# EasyEDA Pro project MCP41010_移相器.eprj

# Schematic Schematic1
Board Name: Board1; Create Date: 2025-01-24; Page Name: P1; Project Name: 移相器; Schematic Name: Schematic1; Update Date: 2025-01-27; Company: 嘉立创EDA; Page Size: A4; Version: V1.0
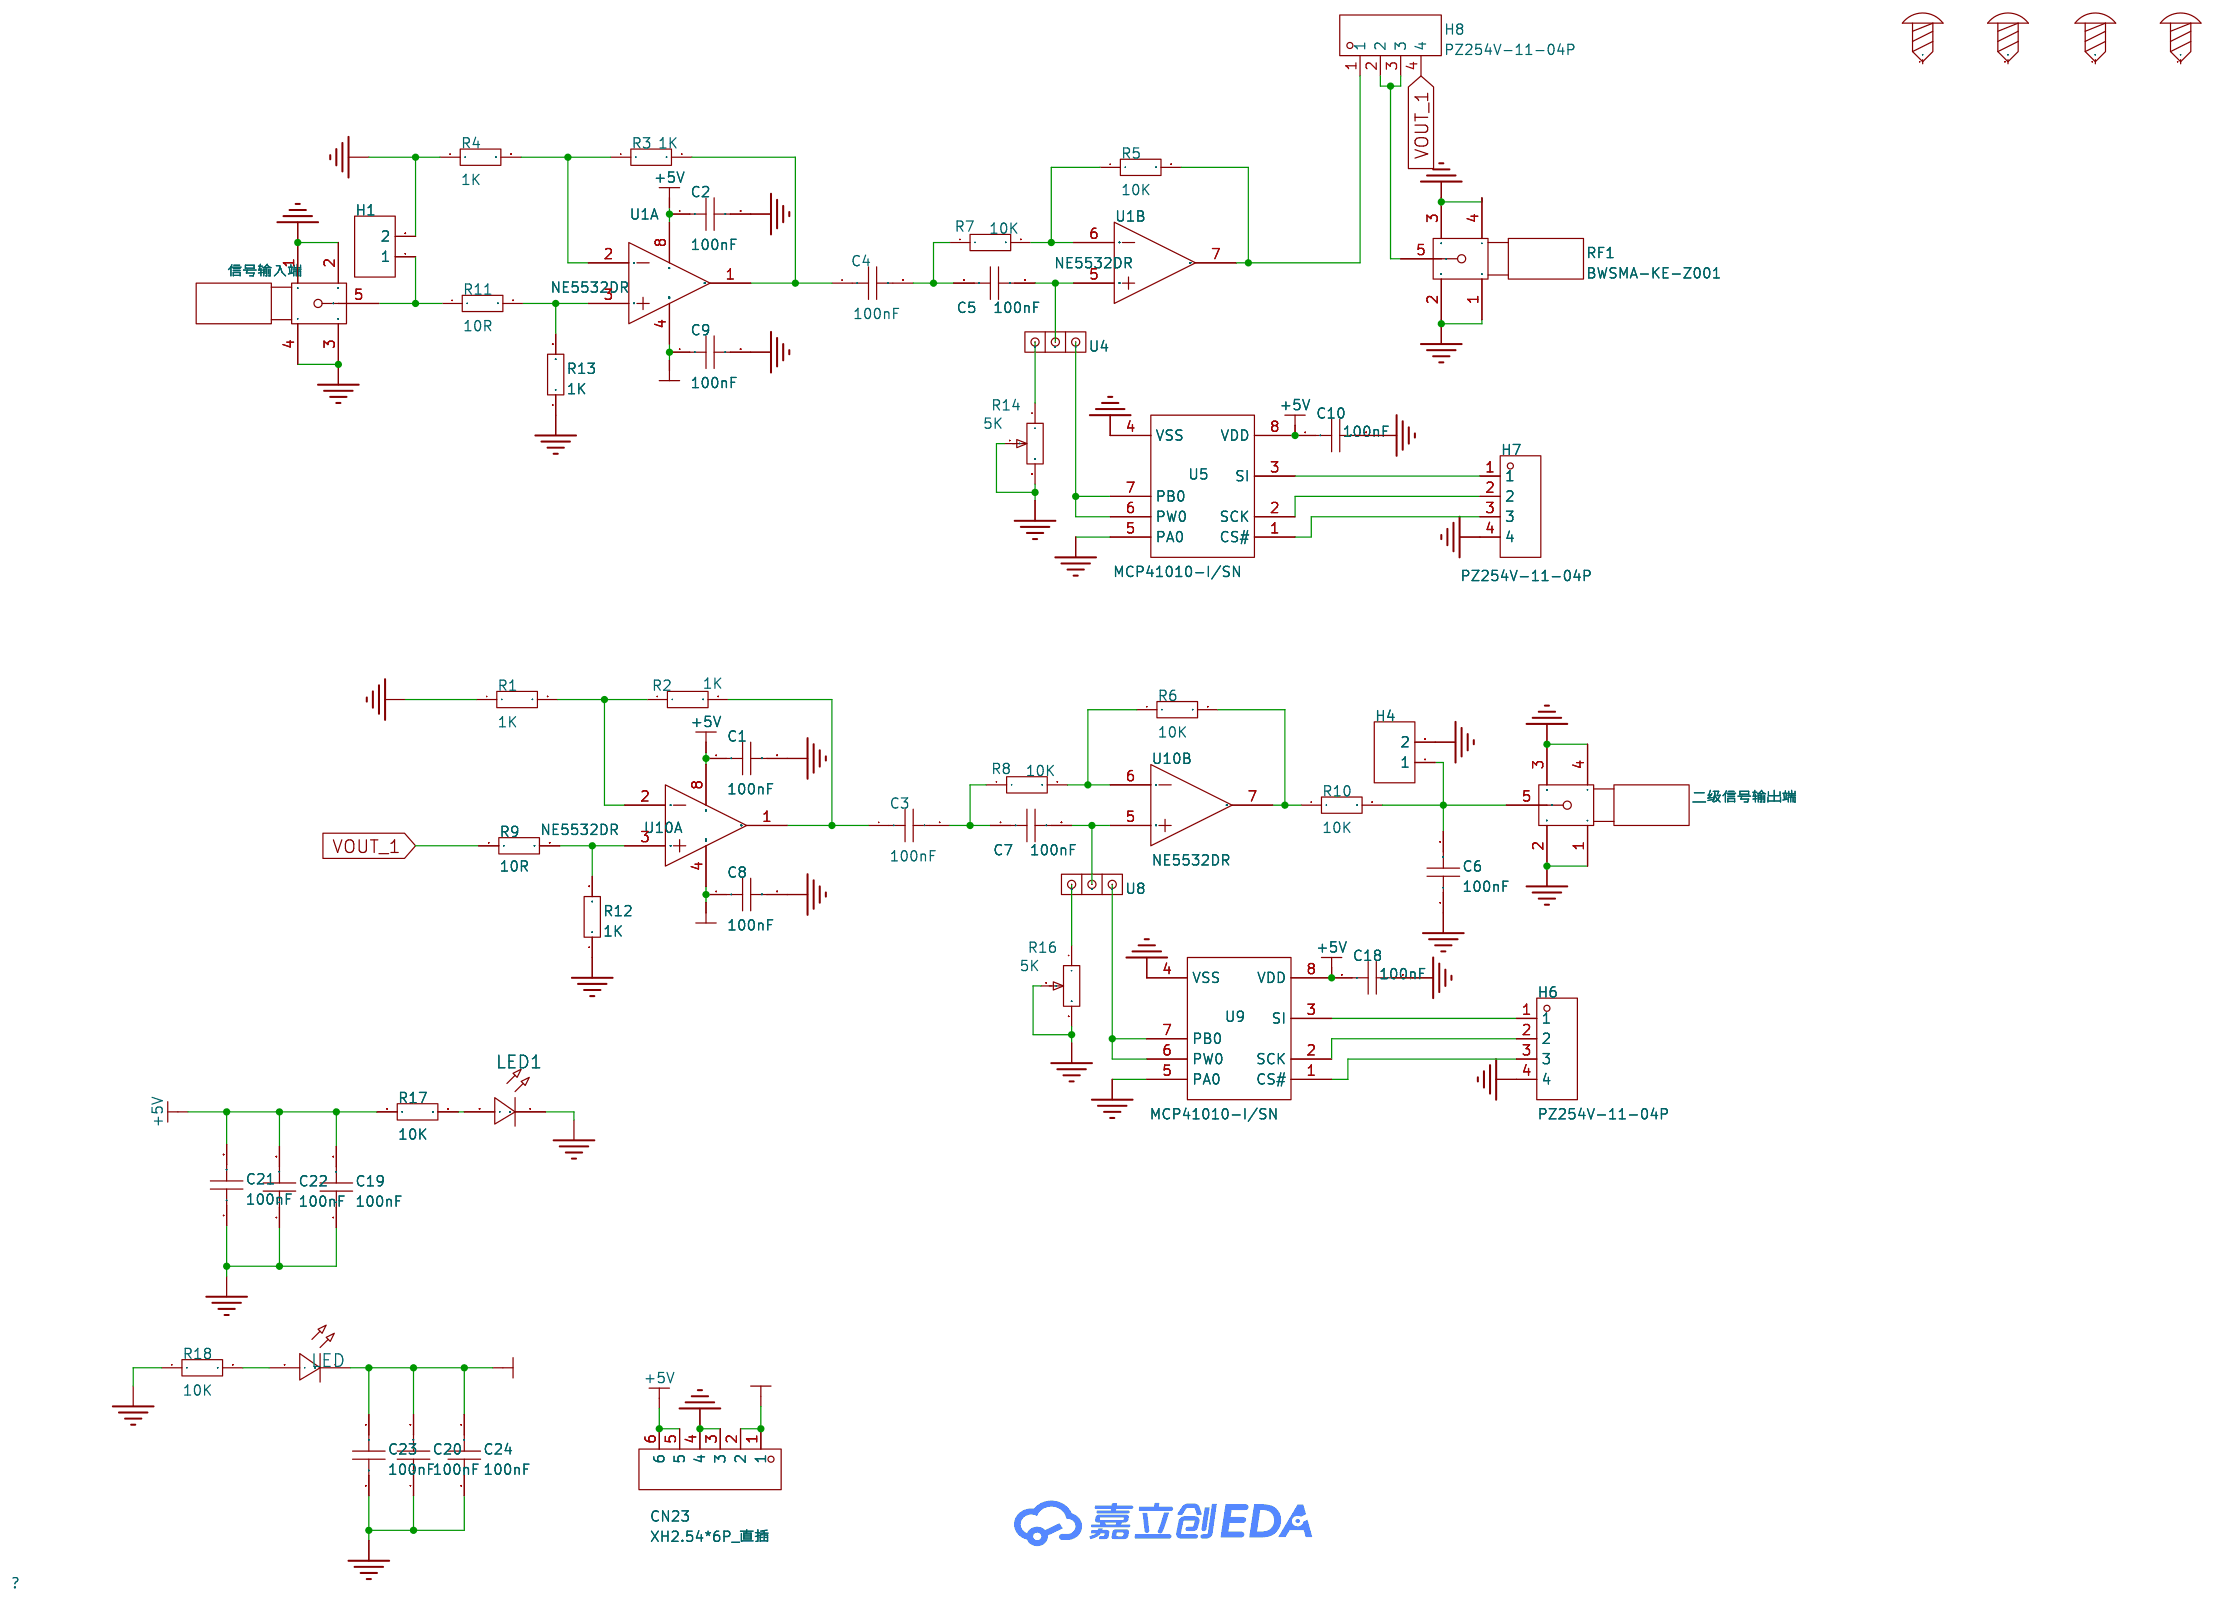
[diagram p0: schematic sheet]

## Parts
C1  100nF  [C0805]
C2  100nF  [C0805]
C3  100nF  [C0805]
C4  100nF  [C0805]
C5  100nF  [C0805]
C6  100nF  [C0805]
C7  100nF  [C0805]
C8  100nF  [C0805]
C9  100nF  [C0805]
C10  100nF  [C0805]
C18  100nF  [C0805]
C19  100nF  [C1206]
C20  100nF  [C1206]
C21  100nF  [C0805]
C22  100nF  [C0805]
C23  100nF  [C0805]
C24  100nF  [C0805]
CN23  XH2.54*6P_直插  [CONN-TH_XH2.54-6P]
H1  -  [HDR-TH_2P-P2.54-V-F]
H4  -  [HDR-TH_2P-P2.54-V-F]
H6  PZ254V-11-04P  [HDR-TH_4P-P2.54-V-M]
H7  PZ254V-11-04P  [HDR-TH_4P-P2.54-V-M]
H8  PZ254V-11-04P  [HDR-TH_4P-P2.54-V-M]
LED  -  [LED_0805]
LED1  -  [LED_0805]
R1  1K  [R0805]
R2  1K  [R0805]
R3  1K  [R0805]
R4  1K  [R0805]
R5  10K  [R0805]
R6  10K  [R0805]
R7  10K  [R0805]
R8  10K  [R0805]
R9  10R  [R0805]
R10  10K  [R0805]
R11  10R  [R0805]
R12  1K  [R0805]
R13  1K  [R0805]
R14  5K  [R_3296]
R16  5K  [R_3296]
R17  10K  [R0805]
R18  10K  [R0805]
RF1  BWSMA-KE-Z001  [SMA-TH_BWSMA-KE-Z001]
SCREW1  -  [M3螺丝]
SCREW2  -  [M3螺丝]
SCREW3  -  [M3螺丝]
SCREW4  -  [M3螺丝]
U1  NE5532DR  [SOIC-8_L4.9-W3.9-P1.27-LS6.0-BL]  (sections 1,2)
U4  -  [1*3跳线]
U5  MCP41010-I/SN  [SOIC-8_L4.9-W3.9-P1.27-LS6.0-BL]
U8  -  [1*3跳线]
U9  MCP41010-I/SN  [SOIC-8_L4.9-W3.9-P1.27-LS6.0-BL]
U10  NE5532DR  [SOIC-8_L4.9-W3.9-P1.27-LS6.0-BL]  (sections 1,2)
二级信号输出端  -  [SMA]
信号输入端  -  [SMA]

## Library data of the parts
C1-C10 C18 C21-C24 = CAP_0805: Supplier Footprint: 0805
C19 C20 = CAP_1206: Supplier Footprint: 1206
CN23 = XH2.54*6P_直插: Supplier Part: C9900008614; Supplier Footprint: XH2.54_6P; JLCPCB Part Class: 扩展库; Supplier: LCSC
H1 H4 = HDR-F_2.54_1x2P: Supplier Part: C49661; Supplier Footprint: 插件
H6-H8 = PZ254V-11-04P: LCSC Part Name: 间距:2.54mm 1x4P 直插 方针; Supplier Part: C2691448; Manufacturer: XFCN(兴飞); Supplier Footprint: 插件,P=2.54mm; JLCPCB Part Class: 扩展库; Datasheet: https://atta.szlcsc.com/upload/public/pdf/source/20200309/C492403_F9F19131791D08044AD4F84F8E751A34.pdf; Supplier: LCSC; Pin Structure: 1x4P; Pitch: 2.54mm; Circluar Pins/Square Pins: 方针; Mounting Type: 直插; Number of Rows: 单排; Number of Pins: 4P; Current Rating (Max): 3A; Voltage Rating (Max): 250V; Length of Mating Pin: 6mm; Insulation Height: 2.5mm; Length of End Connection Pin: 3mm; Operating Temperature Range: -40℃~+105℃; Color: 黑色
LED LED1 = LED_0805-R: Supplier Footprint: 0805
R1-R13 R17 R18 = Res_0805: Supplier Footprint: 0805
R14 R16 = R_3296: Supplier Footprint: 直插
RF1 = BWSMA-KE-Z001_C496549: LCSC Part Name: 内孔 SMA 正脚; Supplier Part: C496549; Manufacturer: BAT WIRELESS(蝙蝠无线); Supplier Footprint: 插件; JLCPCB Part Class: Extended Part; Datasheet: https://atta.szlcsc.com/upload/public/pdf/source/20221228/40BF41E56A06003A0210E1785CA66EA6.pdf; Supplier: LCSC; Connector Type: 板端; Interface Type: 内孔; Number of Ports: 1; RF Series: SMA; Impedance: 50Ω; Style: 正脚; Operating Temperature Range: -65℃~+165℃
SCREW1-SCREW4 = M3螺丝: Supplier Footprint: 插件
U1 U10 = NE5532DR: Supplier Part: C7426; Manufacturer: TI(德州仪器); Supplier Footprint: SOIC-8; JLCPCB Part Class: 基础库; Datasheet: http://www.ti.com/cn/lit/gpn/ne5532; Supplier: LCSC; Number of Circuits: 双路; Gain Bandwidth Product(GBP): 10MHz; Current - Input Bias(Ib): 200nA; Slew Rate(SR): 9V/us; Output Current: 38mA; Supply Current: 8mA; Operating Temperature: 0℃~+70℃
U4 U8 = 1*3跳线
U5 U9 = MCP41010-I/SN: 电阻值(欧姆):10kΩ;精度:±20%;供电电压:2.7V~5.5V;接口类型:SPI;; Supplier Part: C17064; Manufacturer: MICROCHIP(美国微芯); Supplier Footprint: SOIC-8; JLCPCB Part Class: 扩展库; Datasheet: https://atta.szlcsc.com/upload/public/pdf/source/20220205/C2666606_C5E8E7A5F3891B321C1555D845654E7B.pdf; Supplier: LCSC; Resistance Value (Ohms): 10kΩ; Number of Taps: 256; Number of Channels: 1; Precision: ±20%; Supply Voltage: 2.7V~5.5V; Interface Type: SPI; Temperature Coefficient (Typ): 800ppm/℃; Operating Temperature: -40℃~+85℃
二级信号输出端 信号输入端 = SMA

## Nets
+5V: C1.1 C2.1 C10.1 C18.1 C19.2 C21.2 C22.2 CN23.5 CN23.6 R17.1 U1.8(VCC+) U5.8(VDD) U9.8(VDD) U10.8(VCC+)
-5V: C8.1 C9.1 C20.2 C23.1 C24.1 CN23.1 CN23.2 LED.1(C) U1.4(VCC-/GND) U10.4(VCC-/GND)
GND: C1.2 C2.2 C6.1 C8.2 C9.2 C10.2 C18.2 C19.1 C20.1 C21.1 C22.1 C23.2 C24.2 CN23.3 CN23.4 H1.2 H4.2 H6.4 H7.4 LED1.1(C) R1.1 R4.1 R12.1 R13.1 R14.2 R14.3 R16.2 R16.3 R18.1 RF1.1 RF1.2 RF1.3 RF1.4 U5.4(VSS) U5.5(PA0) U9.4(VSS) U9.5(PA0) 二级信号输出端.1 二级信号输出端.2 二级信号输出端.3 二级信号输出端.4 信号输入端.1 信号输入端.2 信号输入端.3 信号输入端.4
VOUT_1: H8.4 R9.1
$1N2754: LED.2(A) R18.2
$1N2755: LED1.2(A) R17.2
$1N4308: R11.2 R13.2 U1.3(IN1+)
$1N4321: R3.1 R4.2 U1.2(IN1-)
$1N4339: C4.1 R3.2 U1.1(OUT1)
$1N4471: H1.1 R11.1 信号输入端.5
$1N4505: C5.2 U1.5(IN2+) U4.2
$1N4512: C4.2 C5.1 R7.1
$1N4538: R5.1 R7.2 U1.6(IN2-)
$1N4574: H8.1 R5.2 U1.7(OUT2)
$1N5056: U4.1 U5.6(PW0) U5.7(PB0)
$1N6369: U8.1 U9.6(PW0) U9.7(PB0)
$1N6371: C3.2 C7.1 R8.1
$1N6373: C3.1 R2.2 U10.1(OUT1)
$1N6375: C6.2 H4.1 R10.2 二级信号输出端.5
$1N6376: R6.2 R10.1 U10.7(OUT2)
$1N6377: C7.2 U8.2 U10.5(IN2+)
$1N6378: R6.1 R8.2 U10.6(IN2-)
$1N6380: R1.2 R2.1 U10.2(IN1-)
$1N6381: R9.2 R12.2 U10.3(IN1+)
$1N6959: H6.1 U9.3(SI)
$1N6964: H6.2 U9.2(SCK)
$1N6973: H6.3 U9.1(CS#)
$1N7566: H7.3 U5.1(CS#)
$1N7569: H7.1 U5.3(SI)
$1N7571: H7.2 U5.2(SCK)
$1N7588: R14.1 U4.3
$1N7623: R16.1 U8.3
$1N11064: H8.2 H8.3 RF1.5

Not connected (* = marked no-connect by the designer): SCREW1 1; SCREW2 1; SCREW3 1; SCREW4 1

# Board PCB1
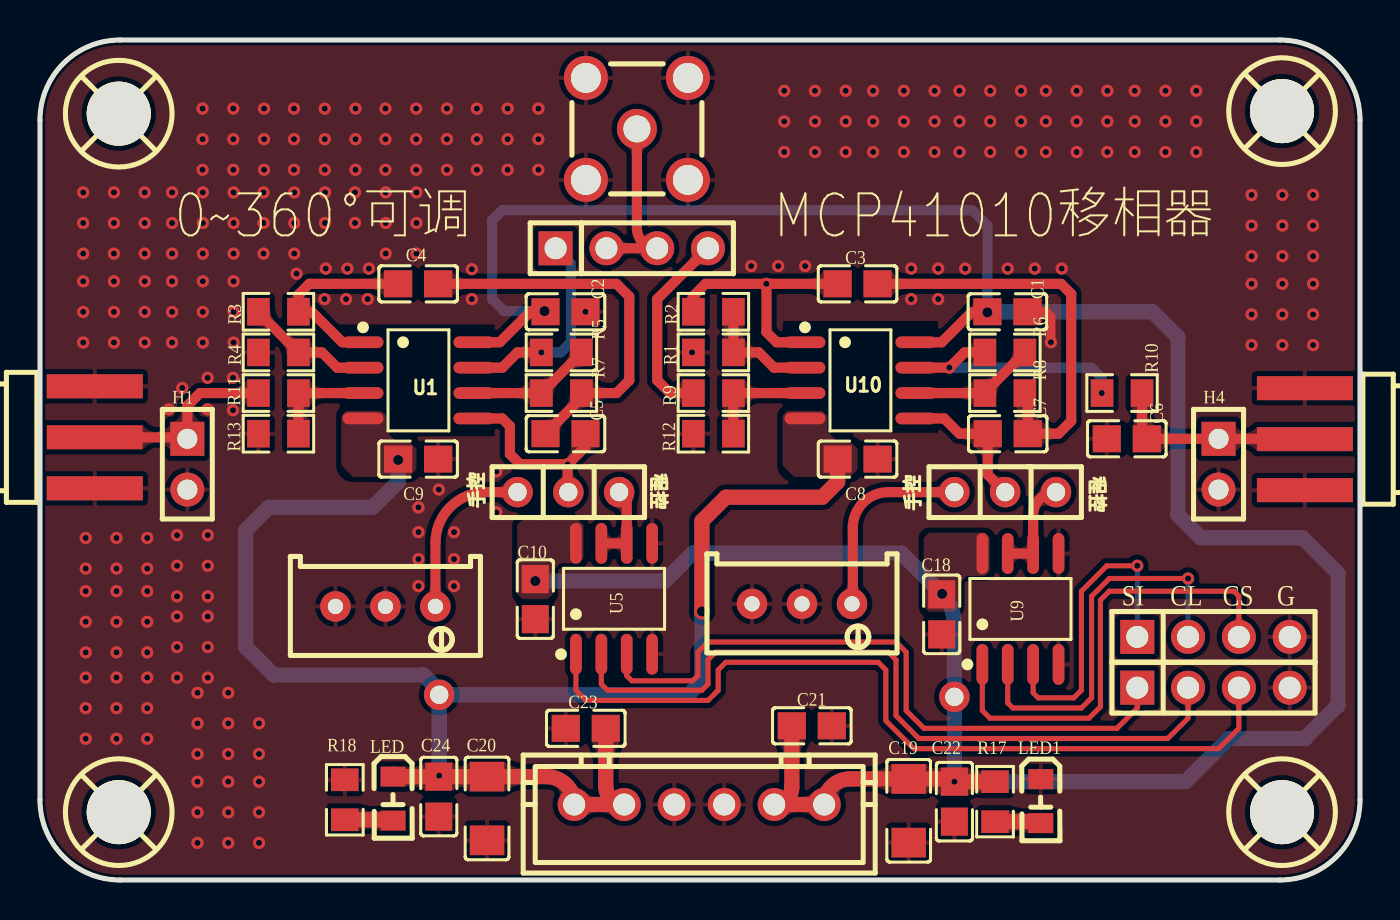
[diagram p1: board, top side]
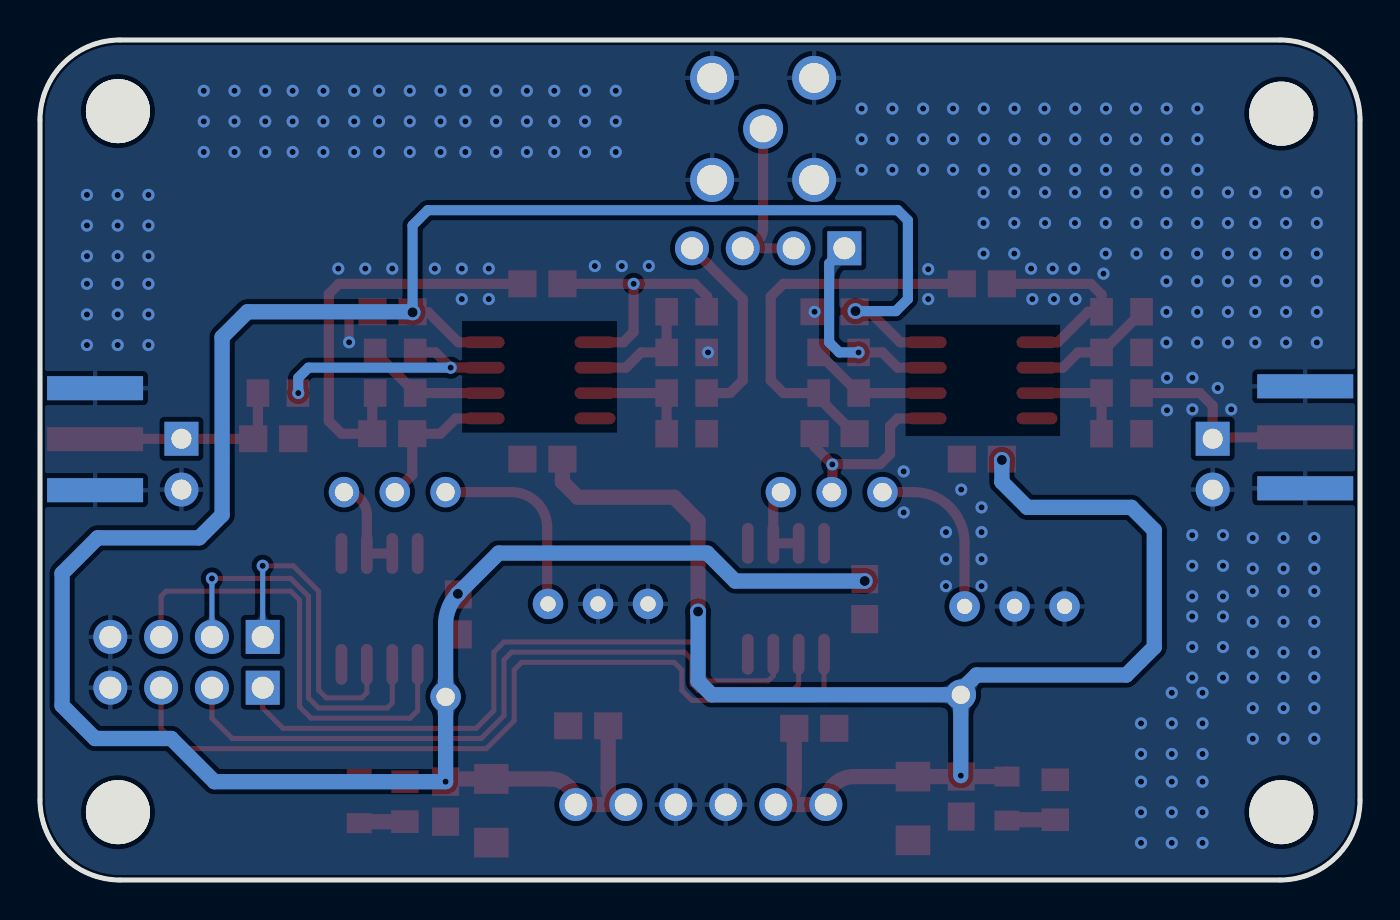
[diagram p2: board, bottom side, seen from below]

Outline 66 x 42 mm; copper layers: Top Layer, Bottom Layer. Coordinates in mm from the lower left corner of the outline.
Outline path: 0,38 0,4 arc(1.17,1.17) 4,0 62,0 arc(64.83,1.17) 66,4 66,38 arc(64.83,40.83) 62,42 4,42 arc(1.17,40.83) 0,38
Stack: Top Layer 0.035mm / Dielectric1 1.51mm FR4 er 4.5 / Bottom Layer 0.035mm

## Design rules (mm)
template: JLCPCB Capability(Two Layers Board)
spacing copperThickness1oz (default): track to track 0.102, other pairs 0.152 to 0.3
spacing copperThickness2oz: track to track 0.203, other pairs 0.152 to 0.3
track width copperThickness1oz (default): min 0.127, default 0.254, max 2.54
track width copperThickness2oz: min 0.203, default 0.254, max 2.54
differential pair differentialPair (default): width min 0.127, default 0.254, max 2.54; gap min 0.152, default 0.152
via viaSize (default): diameter min 0.5, default 0.61, max 10; hole min 0.3, default 0.305, max 6.3

## Placement (name value [footprint] x y rotation side)
C1  100nF  [C0805]  48.37 28.41 0 top
C2  100nF  [C0805]  26.27 28.41 0 top
C3  100nF  [C0805]  40.88 29.81 0 top
C4  100nF  [C0805]  18.91 29.81 0 top
C5  100nF  [C0805]  26.27 22.32 0 top
C6  100nF  [C0805]  54.34 22.06 0 top
C7  100nF  [C0805]  48.39 22.32 180 top
C8  100nF  [C0805]  40.88 21.05 0 top
C9  100nF  [C0805]  18.91 21.05 0 top
C10  100nF  [C0805]  24.76 14.04 270 top
C18  100nF  [C0805]  45.09 13.28 270 top
C19  100nF  [C1206]  43.43 3.46 90 top
C20  100nF  [C1206]  22.35 3.58 90 top
C21  100nF  [C0805]  38.59 7.71 180 top
C22  100nF  [C0805]  45.72 3.92 90 top
C23  100nF  [C0805]  27.29 7.58 180 top
C24  100nF  [C0805]  19.94 4.17 270 top
CN23  XH2.54*6P_直插  [CONN-TH_XH2.54-6P]  32.96 3.77 0 top
H1  -  [HDR-TH_2P-P2.54-V-F]  7.37 20.79 270 top
H4  -  [HDR-TH_2P-P2.54-V-F]  58.93 20.79 270 top
H6  PZ254V-11-04P  [HDR-TH_4P-P2.54-V-M]  58.67 12.16 0 top
H7  PZ254V-11-04P  [HDR-TH_4P-P2.54-V-M]  58.67 9.62 0 top
H8  PZ254V-11-04P  [HDR-TH_4P-P2.54-V-M]  29.59 31.59 0 top
LED  -  [LED_0805]  17.65 4.02 270 top
LED1  -  [LED_0805]  50.03 3.89 270 top
NOREF  -  [Pad_e531]  19.96 9.26 0 top
NOREF#2  -  [Pad_e533]  45.72 9.16 0 top
R1  1K  [R0805]  33.67 26.38 0 top
R2  1K  [R0805]  33.67 28.41 180 top
R3  1K  [R0805]  11.92 28.41 0 top
R4  1K  [R0805]  11.92 26.38 0 top
R5  10K  [R0805]  26.07 26.38 180 top
R6  10K  [R0805]  48.24 26.38 180 top
R7  10K  [R0805]  26.07 24.35 180 top
R8  10K  [R0805]  48.24 24.35 180 top
R9  10R  [R0805]  33.67 24.35 0 top
R10  10K  [R0805]  54.1 24.35 0 top
R11  10R  [R0805]  11.92 24.35 0 top
R12  1K  [R0805]  33.67 22.32 0 top
R13  1K  [R0805]  11.92 22.32 0 top
R14  5K  [R_3296]  17.27 13.55 180 top
R16  5K  [R_3296]  38.1 13.68 180 top
R17  10K  [R0805]  47.75 3.92 270 top
R18  10K  [R0805]  15.24 4.01 270 top
RF1  BWSMA-KE-Z001  [SMA-TH_BWSMA-KE-Z001]  29.84 37.56 0 top
SCREW1  -  [M3螺丝]  3.94 3.39 0 top
SCREW2  -  [M3螺丝]  62.1 38.44 0 top
SCREW3  -  [M3螺丝]  62.1 3.39 0 top
SCREW4  -  [M3螺丝]  3.94 38.32 0 top
U1  NE5532DR  [SOIC-8_L4.9-W3.9-P1.27-LS6.0-BL]  18.92 24.98 270 top
U4  -  [1*3跳线]  23.88 19.39 270 top
U5  MCP41010-I/SN  [SOIC-8_L4.9-W3.9-P1.27-LS6.0-BL]  28.7 14.06 0 top
U8  -  [1*3跳线]  45.72 19.39 270 top
U9  MCP41010-I/SN  [SOIC-8_L4.9-W3.9-P1.27-LS6.0-BL]  49.02 13.55 0 top
U10  NE5532DR  [SOIC-8_L4.9-W3.9-P1.27-LS6.0-BL]  41.02 24.98 270 top
二级信号输出端  -  [SMA]  67.06 27.9 180 top
信号输入端  -  [SMA]  -1.07 16.27 0 top

## Footprints (pads in the part's own frame, mm; a bottom-side part is the same pattern mirrored in y, then rotated)
1*3跳线
  round 1.524 hole 0.914: 1(0,5.08) 2(0,2.54) 3(0,0)
C0805
  rect 1.41x1.35 smd: 1(-1,0) 2(1,0)
C1206
  rect 1.485x1.728 smd: 1(-1.593,0) 2(1.593,0)
CONN-TH_XH2.54-6P
  round 1.65 hole 1.1: 1(-6.25,0) 2(-3.75,0) 3(-1.25,0) 4(1.25,0) 5(3.75,0) 6(6.25,0)
HDR-TH_2P-P2.54-V-F
  rect 1.7x1.7 hole 1: 1(-1.27,0)
  round 1.7 hole 1: 2(1.27,0)
HDR-TH_4P-P2.54-V-M
  rect 1.7x1.7 hole 1.1: 1(-3.81,0)
  round 1.7 hole 1.1: 2(-1.27,0) 3(1.27,0) 4(3.81,0)
LED_0805
  rect 1x1.25 smd: 1(-1.15,0.005) 2(1.05,0.005)
M3螺丝
  round 3.2 hole 3.2: 1(0,0)
Pad_e531
  round 1.524 hole 0.914: 1(0,0)
Pad_e533
  round 1.524 hole 0.914: 1(0,0)
R0805
  rect 1.133x1.377 smd: 1(-1,0) 2(1,0)
R_3296
  round 1.524 hole 0.762: 1(-2.499,-0.127) 2(0,-0.127) 3(2.499,-0.127)
SMA
  rect 4.8x1.2 smd: 1(3.81,8.412) 2(3.81,3.312) 5(3.81,5.862)
  rect 4.8x1.2 smd far side: 3(3.81,3.312) 4(3.81,8.412)
SMA-TH_BWSMA-KE-Z001
  round 2.2 hole 1.5: 1(-2.55,-2.55) 2(-2.55,2.55) 3(2.55,2.55) 4(2.55,-2.55)
  round 2 hole 1.35: 5(0,0)
SOIC-8_L4.9-W3.9-P1.27-LS6.0-BL
  oval 0.588x2.045 smd: 1(-1.905,-2.772) 2(-0.635,-2.772) 3(0.635,-2.772) 4(1.905,-2.772) 5(1.905,2.772) 6(0.635,2.772) 7(-0.635,2.772) 8(-1.905,2.772)

## Nets
As in the schematic, except:
+5V: C1.1 C2.1 C10.1 C18.1 C19.2 C21.2 C22.2 CN23.5 CN23.6 NOREF#2.1 R17.1 U1.8 U5.8 U9.8 U10.8
-5V: C8.1 C9.1 C20.2 C23.1 C24.1 CN23.1 CN23.2 LED.1 NOREF.1 U1.4 U10.4

Pads without a net: SCREW1 1; SCREW2 1; SCREW3 1; SCREW4 1

## Via types
v1: diameter 0.8, hole 0.5, Top Layer to Bottom Layer, 6 vias
v2: diameter 0.61, hole 0.305, Top Layer to Bottom Layer, 252 vias

## Routing (per net, layer and track width the routed paths; a pad name or vN(x,y) marks a point on that pad's centre or on a via; arc(x,y) is an arc through that point)
+5V: length 148
  Top Layer w0.508: v1(47.37,28.38) 46.58,28.38 45.09,26.89 U10.8 ; v1(25.23,28.45) 24.55,28.45 22.99,26.89 U1.8
  Top Layer w0.762: R17.1 v2(45.72,4.92) arc(45.68,5.01) 45.58,5.05 C19.2 40.49,5.05 arc(39.58,4.68) CN23.6 CN23.5 arc(37.33,4.03) 37.59,4.66 C21.2
  Bottom Layer w0.508: v1(25.23,28.45) 23.21,28.45 22.61,29.05 22.61,32.98 23.11,33.49 46.61,33.49 47.37,32.73 v1(47.37,28.38)
  Bottom Layer w0.762: v1(45.1,14.31) 43.07,16.35 32.64,16.35 31.24,14.95 v1(24.76,14.95) ; v1(47.37,28.38) 47.4,28.41 55.63,28.41 56.9,27.14 56.9,18.25 58.04,17.11 63.12,17.11 64.9,15.33 64.9,8.73 63.25,7.08 59.44,7.08 57.28,4.92 v2(45.72,4.92) NOREF#2.1 45.72,12.78 arc(45.55,13.61) 45.09,14.31
-5V: length 77.3
  Top Layer w0.762: C8.1 39.88,19.9 39.12,19.14 34.29,19.14 33.1,17.95 v1(33.1,13.43) ; C23.1 28.29,4.69 arc(28.56,4.04) CN23.2 CN23.1 arc(26.3,4.76) 25.31,5.17 C20.2 C24.1 17.78,5.17 arc(17.69,5.21) 17.65,5.3
  Bottom Layer w0.762: v1(33.1,13.43) 33.1,9.95 32.41,9.26 NOREF.1 ; v1(17.91,21) 17.91,19.9 16.64,18.63 11.43,18.63 10.29,17.49 10.29,11.65 11.68,10.25 19.18,10.25 19.96,9.47 NOREF.1 ; v2(19.96,5.22) NOREF.1
GND: length 2.6
  Top Layer w0.457: v2(50.55,26.89) 50.55,28.16 50.29,28.41 C1.2
  vias: v2(2.16,34.38) v2(2.16,32.85) v2(2.16,31.32) v2(2.16,29.94) v2(2.16,28.41) v2(2.16,26.88) v2(2.29,17.1) v2(2.29,15.57) v2(2.29,14.44) v2(2.29,12.91) v2(2.29,11.38) v2(2.29,10.12) v2(2.29,8.59) v2(2.29,7.06) v2(3.7,34.38) v2(3.7,32.85) v2(3.7,31.32) v2(3.7,29.94) v2(3.7,28.41) v2(3.7,26.88) v2(3.82,17.1) v2(3.82,15.57) v2(3.82,14.44) v2(3.82,12.91) v2(3.82,11.38) v2(3.82,10.12) v2(3.82,8.59) v2(3.82,7.06) v2(5.23,34.38) v2(5.23,32.85) v2(5.23,31.32) v2(5.23,29.94) v2(5.23,28.41) v2(5.23,26.88) v2(5.36,17.1) v2(5.36,15.57) v2(5.36,14.44) v2(5.36,12.91) v2(5.36,11.38) v2(5.36,10.12) v2(5.36,8.59) v2(5.36,7.06) v2(6.44,23.53) v2(6.6,34.38) v2(6.6,32.85) v2(6.6,31.32) v2(6.6,29.94) v2(6.6,28.41) v2(6.6,26.88) v2(6.85,17.24) v2(6.85,15.71) v2(6.85,14.18) v2(6.85,13.18) v2(6.85,11.65) v2(6.85,10.12) v2(7.11,24.6) v2(7.87,9.36) v2(7.87,7.83) v2(7.87,6.3) v2(7.87,4.92) v2(7.87,3.39) v2(7.87,1.86) v2(8.13,38.57) v2(8.13,37.04) v2(8.13,35.51) v2(8.14,34.38) v2(8.14,32.85) v2(8.14,31.32) v2(8.14,29.94) v2(8.14,28.41) v2(8.14,26.88) v2(8.38,25.11) v2(8.38,23.53) v2(8.39,17.24) v2(8.39,15.71) v2(8.39,14.18) v2(8.39,13.18) v2(8.39,11.65) v2(8.39,10.12) v2(9.41,9.36) v2(9.41,7.83) v2(9.41,6.3) v2(9.41,4.92) v2(9.41,3.39) v2(9.41,1.86) v2(9.67,38.57) v2(9.67,37.04) v2(9.67,35.51) v2(9.68,34.38) v2(9.68,32.85) v2(9.68,31.32) v2(9.68,29.94) v2(9.68,28.41) v2(9.68,26.88) v2(9.65,25.11) v2(9.65,23.49) v2(10.95,7.83) v2(10.95,6.3) v2(10.95,4.92) v2(10.95,3.39) v2(10.95,1.86) v2(11.2,38.57) v2(11.2,37.04) v2(11.2,35.51) v2(11.18,34.38) v2(11.18,32.85) v2(11.18,31.32) v2(12.7,38.57) v2(12.7,37.04) v2(12.7,35.51) v2(12.71,34.38) v2(12.71,32.85) v2(12.71,31.32) v2(12.83,30.32) v2(14.24,38.57) v2(14.24,37.04) v2(14.24,35.51) v2(14.22,29.05) v2(14.25,34.38) v2(14.25,32.85) v2(14.29,30.57) v2(15.3,29.05) v2(15.37,30.57) v2(15.75,34.38) v2(15.75,32.85) v2(15.78,38.57) v2(15.78,37.04) v2(15.78,35.51) v2(16.45,30.57) v2(16.38,29.05) v2(17.27,38.57) v2(17.27,37.04) v2(17.27,35.51) v2(17.29,34.38) v2(17.29,32.85) v2(17.29,31.32) v2(18.81,38.57) v2(18.81,37.04) v2(18.81,35.51) v2(18.82,34.38) v2(18.82,32.85) v2(18.82,31.32) v2(18.92,18.63) v2(18.92,17.39) v2(18.92,16.04) v2(18.92,14.7) v2(19.94,19.52) v2(20.35,38.57) v2(20.35,37.04) v2(20.35,35.51) v2(20.7,17.39) v2(20.7,16.04) v2(20.7,14.7) v2(21.59,30.54) v2(21.59,29.05) v2(21.84,38.57) v2(21.84,37.04) v2(21.84,35.51) v2(22.82,20.43) v2(22.82,18.38) v2(23.38,38.57) v2(23.38,37.04) v2(23.38,35.51) v2(24.92,38.57) v2(24.92,37.04) v2(24.92,35.51) v2(27.27,28.41) v2(32.6,26.38) v2(35.56,30.7) v2(36.91,30.7) v2(37.21,39.46) v2(37.21,37.93) v2(37.21,36.4) v2(38.26,30.7) v2(38.75,39.46) v2(38.75,37.93) v2(38.75,36.4) v2(40.29,39.46) v2(40.29,37.93) v2(40.29,36.4) v2(41.66,39.46) v2(41.66,37.93) v2(41.66,36.4) v2(43.19,39.46) v2(43.19,37.93) v2(43.19,36.4) v2(43.56,30.57) v2(43.56,29.05) v2(44.73,39.46) v2(44.73,37.93) v2(44.73,36.4) v2(44.91,30.57) v2(44.91,29.05) v2(45.97,39.46) v2(45.97,37.93) v2(45.97,36.4) v2(46.26,30.57) v2(47.51,39.46) v2(47.51,37.93) v2(47.51,36.4) v2(48.39,30.57) v2(49.05,39.46) v2(49.05,37.93) v2(49.05,36.4) v2(49.74,30.57) v2(50.29,39.46) v2(50.29,37.93) v2(50.29,36.4) v2(51.09,30.57) v2(51.83,39.46) v2(51.83,37.93) v2(51.83,36.4) v2(53.37,39.46) v2(53.37,37.93) v2(53.37,36.4) v2(54.74,39.46) v2(54.74,37.93) v2(54.74,36.4) v2(56.27,39.46) v2(56.27,37.93) v2(56.27,36.4) v2(57.81,39.46) v2(57.81,37.93) v2(57.81,36.4) v2(60.58,34.25) v2(60.58,32.72) v2(60.58,31.19) v2(60.58,29.81) v2(60.58,28.28) v2(60.58,26.75) v2(62.12,34.25) v2(62.12,32.72) v2(62.12,31.19) v2(62.12,29.81) v2(62.12,28.28) v2(62.12,26.75) v2(63.65,34.25) v2(63.65,32.72) v2(63.65,31.19) v2(63.65,29.81) v2(63.65,28.28) v2(63.65,26.75)
VOUT_1: length 9.7
  Top Layer w0.508: H8.4 30.86,29.05 30.86,24.98 31.5,24.35 R9.1
$1N2754: length 2.4
  Top Layer w0.762: R18.2 17.61,3.01 arc(17.64,3) LED.2
$1N2755: length 2.5
  Top Layer w0.762: R17.2 50.09,2.92 arc(50.14,2.89) 50.16,2.84
$1N4308: length 4.8
  Top Layer w0.508: 15.64,24.35 R11.2 R13.2
$1N4321: length 6.4
  Top Layer w0.508: U1.2 14.86,25.62 14.1,26.38 R4.2 10.92,28.38 R3.1
$1N4339: length 9.9
  Top Layer w0.508: U1.1 15.11,26.89 13.59,28.41 R3.2 12.92,29.27 13.46,29.81 C4.1
$1N4471: length 10.1
  Top Layer w0.508: 信号输入端.5 7.29,22.13 H1.1 7.37,23.71 8,24.35 R11.1
$1N4505: length 9.8
  Top Layer w0.508: C5.2 27.27,21.67 v2(26.38,20.78) ; v2(26.38,20.78) 26.38,19.47 arc(26.39,19.43) U4.2 ; v2(26.38,20.78) 26.37,20.79 24,20.79 23.5,21.3 23.5,22.7 23.11,23.08 U1.5
$1N4512: length 19.4
  Top Layer w0.508: C5.1 26.9,23.95 arc(27.03,24.13) R7.1 28.83,24.35 29.46,24.98 29.46,29.17 28.83,29.81 C4.2
$1N4538: length 6.2
  Top Layer w0.508: U1.6 R7.2 27.05,26.32 arc(27.06,26.35) R5.1
$1N4574: length 10.4
  Top Layer w0.508: U1.7 23.11,25.62 23.88,26.38 v2(25.07,26.38)
  Bottom Layer w0.508: H8.1 26.54,30.82 26.54,26.89 26.03,26.38 v2(25.07,26.38)
$1N5056: length 4
  Top Layer w0.508: U5.7 U5.6 29.34,19.01 arc(29.23,19.28) U4.1
$1N6369: length 5
  Top Layer w0.508: U9.7 U9.6 49.66,18.25 arc(49.99,19.06) U8.1
$1N6371: length 20.8
  Top Layer w0.508: C3.2 51.05,29.81 51.56,29.3 51.56,22.95 50.93,22.32 C7.1 49.39,24.2 arc(49.35,24.31) R8.1
$1N6373: length 12.8
  Top Layer w0.508: v2(36.32,29.81) 33.27,29.81 32.64,29.17 32.64,28.44 R2.2 ; v2(36.32,29.81) 36.32,29.8 36.32,27.4 36.83,26.89 U10.1 ; v2(36.32,29.81) C3.1
$1N6375: length 9.5
  Top Layer w0.508: R10.2 55.1,22.3 arc(55.17,22.13) C6.2 58.04,22.06 ; H4.1 63.23,22.06 arc(63.24,22.06) 二级信号输出端.5
$1N6376: length 12.4
  Top Layer w0.508: R6.2 46.23,26.38 v2(45.47,25.62) U10.7
  Bottom Layer w0.508: v2(53.09,24.35) 53.09,25.11 52.58,25.62 v2(45.47,25.62)
$1N6377: length 7.2
  Top Layer w0.508: U10.5 45.21,23.08 45.97,22.32 C7.2 47.39,20.27 U8.2
$1N6378: length 6.3
  Top Layer w0.508: R6.1 47.27,24.4 arc(47.25,24.38) R8.2 U10.6
$1N6380: length 5.9
  Top Layer w0.508: R2.1 R1.2 35.94,26.38 36.7,25.62 U10.2
$1N6381: length 5.6
  Top Layer w0.508: U10.3 R9.2 R12.2
$1N6959: length 15.9
  Top Layer w0.254: U9.3 49.66,9.36 49.91,9.11 51.69,9.11 52.07,9.49 52.07,14.44 53.34,15.71 v2(54.86,15.71)
  Bottom Layer w0.254: v2(54.86,15.71) H6.1
$1N6964: length 19.6
  Top Layer w0.254: v2(57.4,15.08) 53.47,15.08 52.58,14.19 52.58,9.11 52.07,8.6 48.64,8.6 48.39,8.85 U9.2
  Bottom Layer w0.254: v2(57.4,15.08) H6.2
$1N6973: length 23.2
  Top Layer w0.254: H6.3 59.94,14.19 59.69,14.44 53.47,14.44 53.02,14 53.02,8.66 52.45,8.09 47.5,8.09 47.12,8.47 U9.1
$1N7566: length 42.3
  Top Layer w0.254: H7.3 59.94,7.58 58.93,6.57 43.69,6.57 42.29,7.96 42.29,10.5 41.91,10.89 34.29,10.89 33.91,10.5 33.91,9.49 33.4,8.98 27.31,8.98 26.8,9.49 U5.1
$1N7569: length 33.1
  Top Layer w0.254: U5.3 29.34,10.21 29.59,9.96 32.64,9.96 32.89,10.21 32.89,11.39 33.4,11.9 42.8,11.9 43.31,11.39 43.31,8.47 44.2,7.58 53.85,7.58 54.86,8.6 H7.1
$1N7571: length 37.8
  Top Layer w0.254: U5.2 28.07,9.79 28.37,9.49 33.1,9.49 33.4,9.79 33.4,11.01 33.78,11.39 42.42,11.39 42.8,11.01 42.8,8.22 43.94,7.08 56.39,7.08 57.4,8.09 H7.2
$1N7588: length 8.7
  Top Layer w0.508: U4.3 22.31,19.39 arc(20.52,18.65) 19.77,16.85 R14.1
$1N7623: length 9.9
  Top Layer w0.508: U8.3 42.42,19.39 arc(41.16,18.87) 40.64,17.62 40.64,13.85 arc(40.63,13.82) 40.6,13.81
$1N11064: length 9.1
  Top Layer w0.508: RF1.5 29.84,32.6 arc(30.14,31.88) 30.86,31.59 H8.2

## Copper pours and planes (outline as drawn; the poured copper is in the pictures)
+5V on Top Layer: 23.86,18 27.18,18 27.18,14.04 23.86,14.04
+5V on Top Layer: 44.18,17.36 47.5,17.36 47.5,13.41 44.18,13.41
-5V on Top Layer: 37.12,23.46 40.88,23.46 40.88,20.14 37.12,20.14
-5V on Top Layer: 15.06,23.45 18.82,23.45 18.82,20.14 15.06,20.14
GND on Top Layer: -5.59,44.67 69.98,44.67 69.98,-7.4 -5.59,-7.4
GND on Bottom Layer: -7.62,44.29 67.94,44.29 67.94,-8.93 -7.62,-8.93
GND on Bottom Layer: -4.44,45.68 71.75,45.68 71.75,-7.53 -4.44,-7.53

Small or netless copper shapes (teardrops, artwork), in the pictures only: 131 on Top Layer, 21 on Bottom Layer

## Text on the board
Top Silkscreen Layer: SI | CL | CS | G | 0~360°可调 | 程控 | 手控 | MCP41010移相器
